# EasyEDA Pro project ProPrj_Altruist.epro, board PCB_Altruist
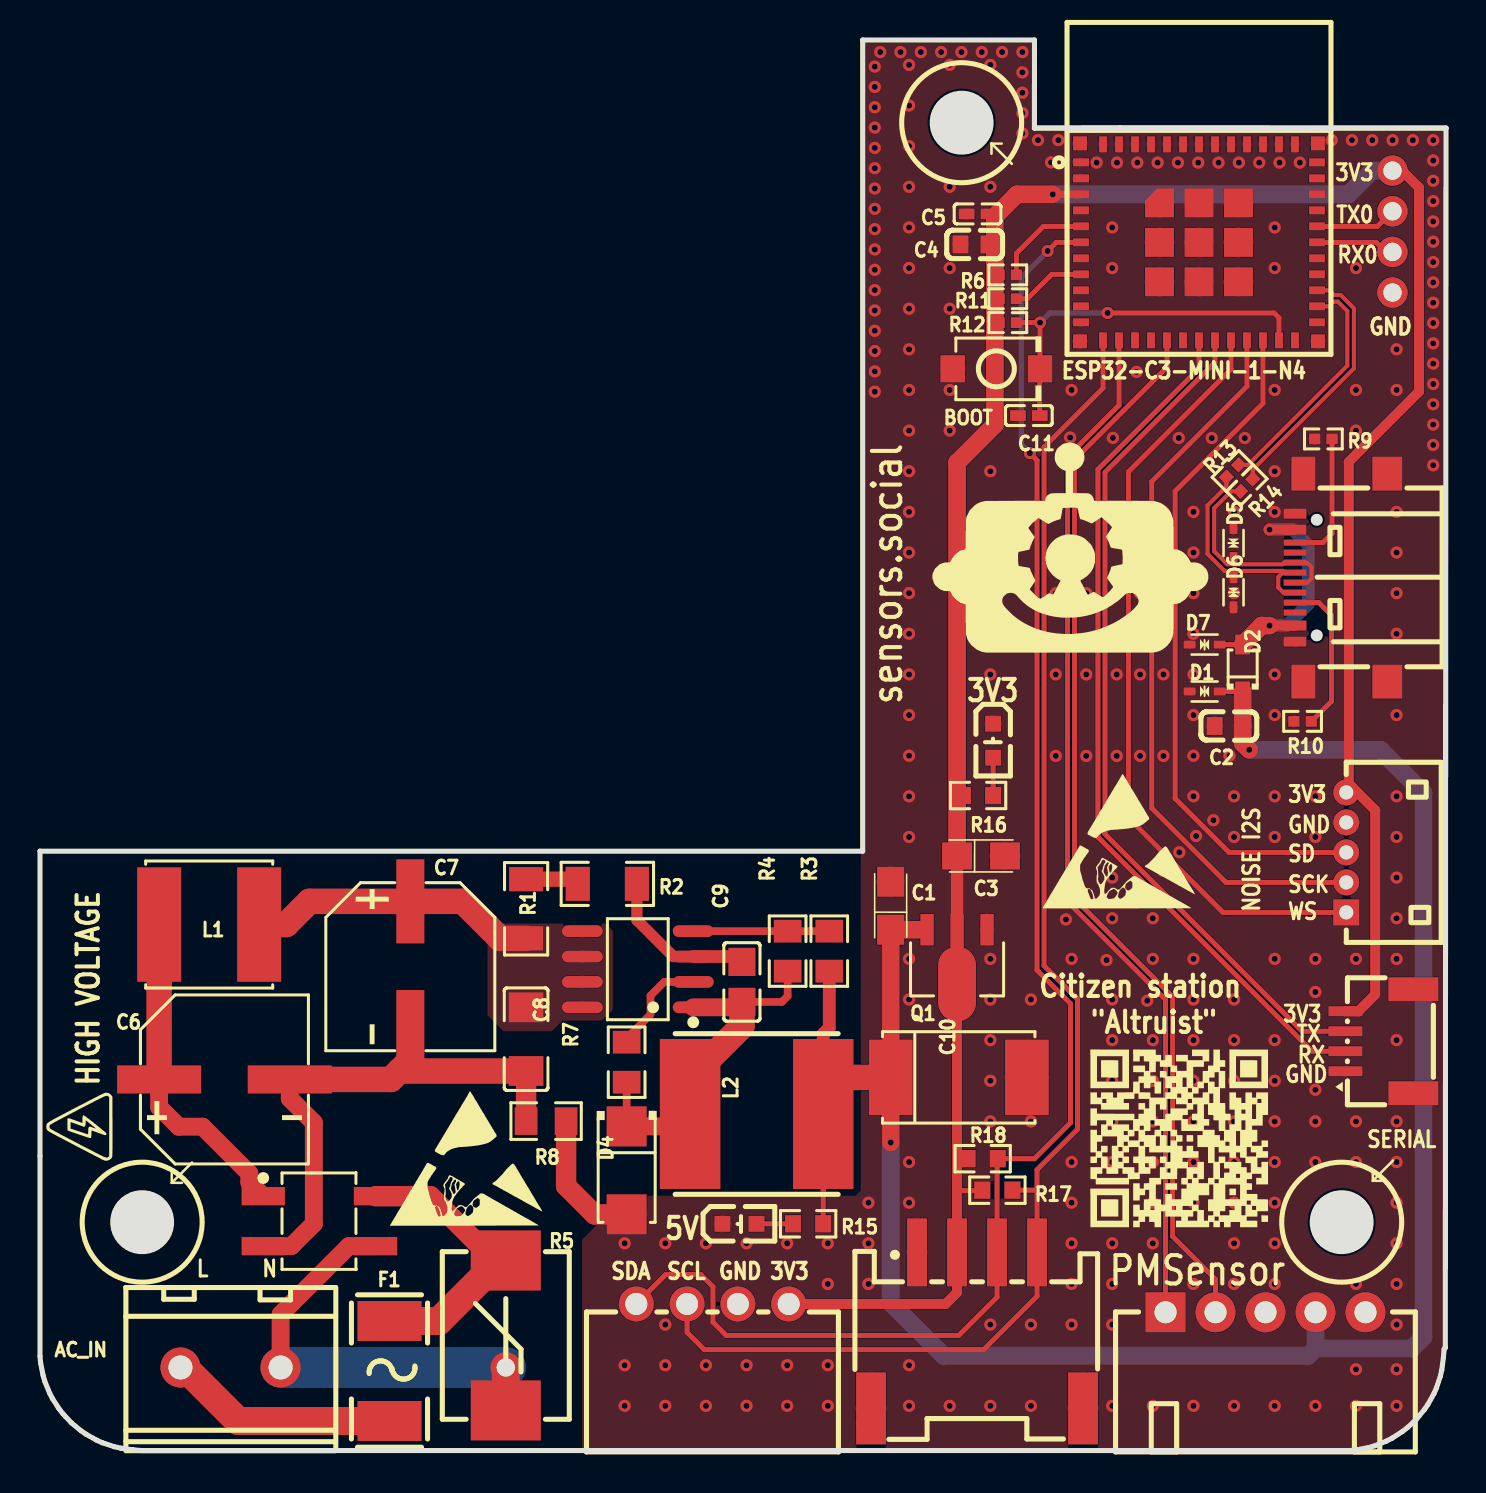
[diagram p7: board, top side]
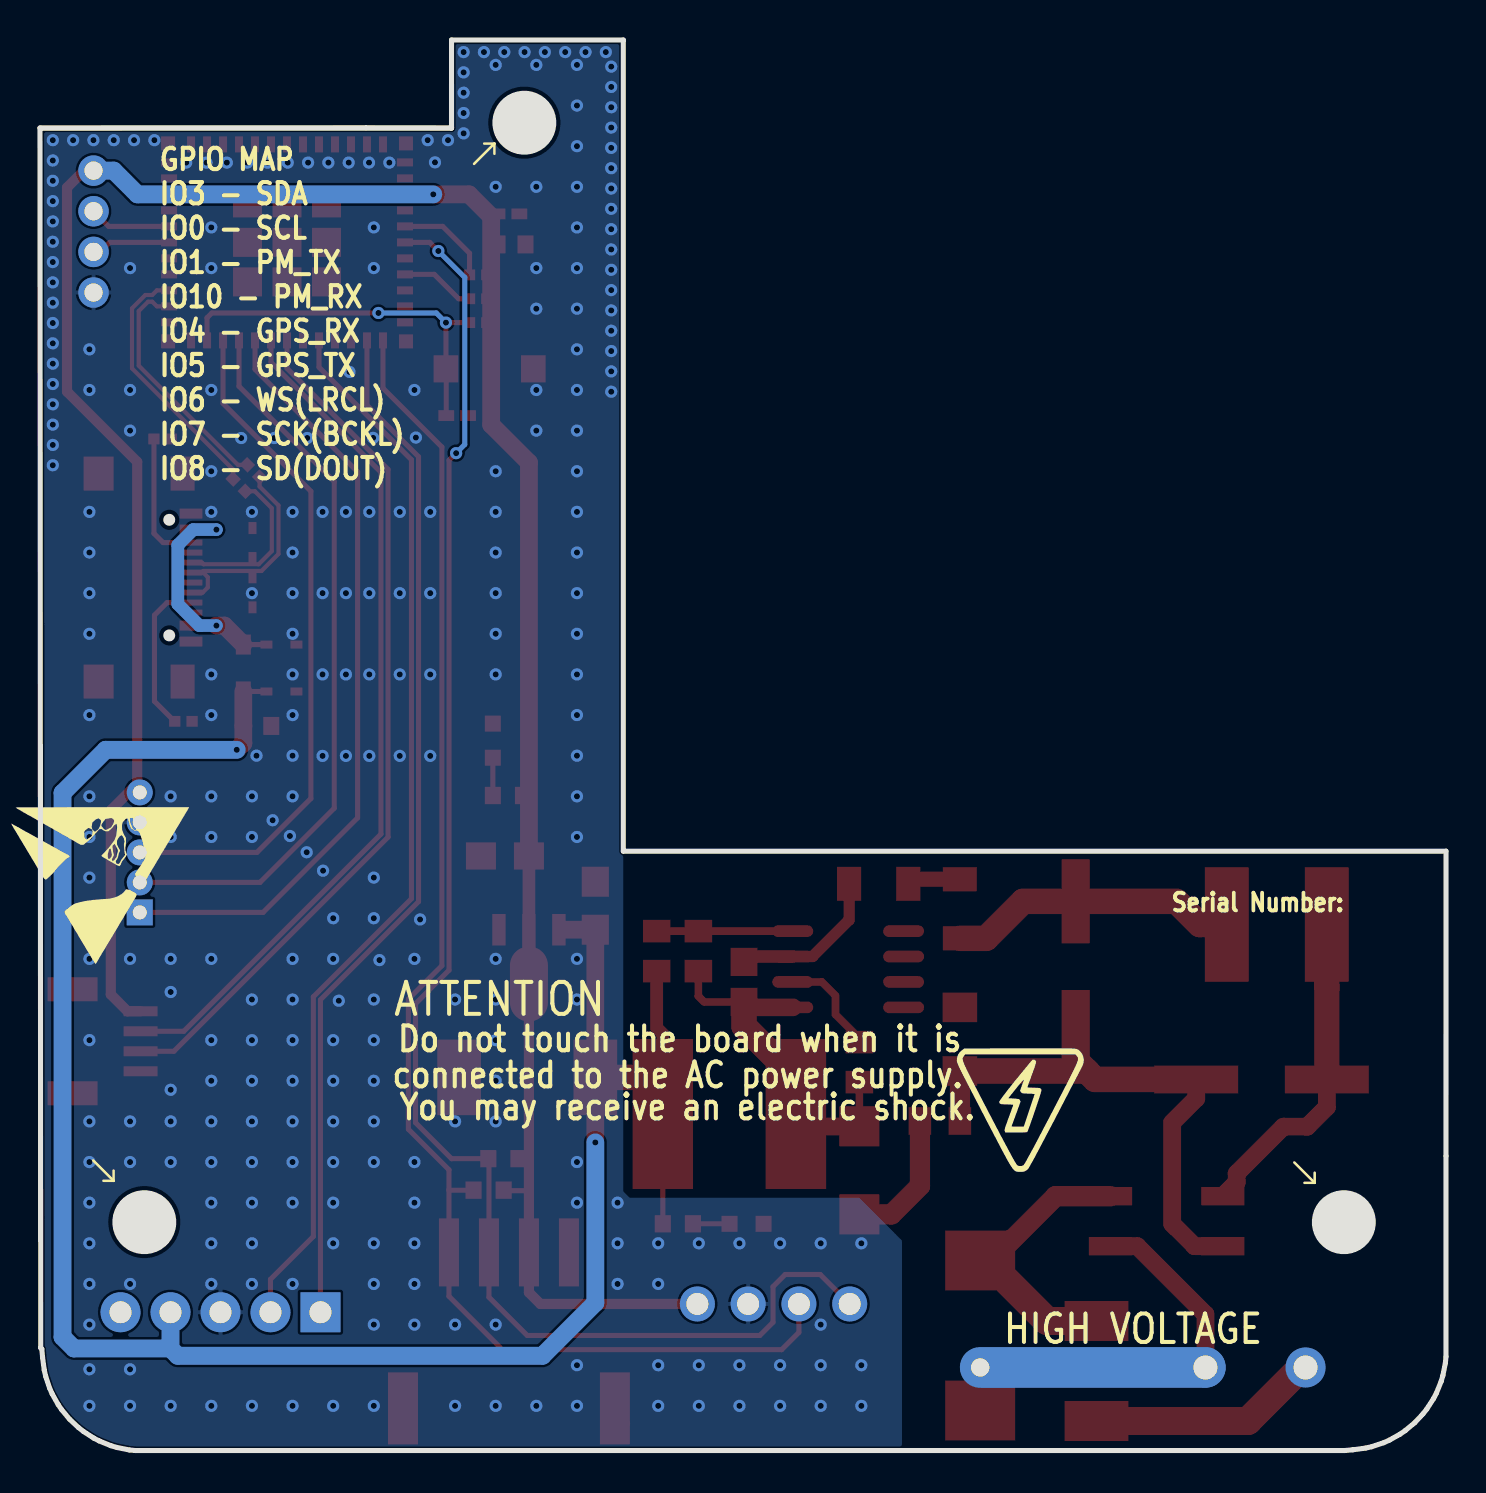
[diagram p8: board, bottom side, seen from below]

Outline 70.32 x 70.54 mm; copper layers: Top Layer, Bottom Layer. Coordinates in mm from the lower left corner of the outline.
Outline path: 49.74,66.13 49.74,70.54 41.15,70.54 41.15,29.97 0,29.97 0,14.73 0,4.7 0.03,4.38 0.16,3.75 0.24,3.45 0.48,2.87 0.62,2.6 0.96,2.08 1.15,1.84 1.57,1.39 2.04,1 2.3,0.82 2.84,0.52 3.12,0.39 3.71,0.19 4.02,0.12 4.66,0.04 5.08,0 65.53,0 65.85,0.03 66.48,0.16 66.78,0.24 67.36,0.48 67.63,0.62 68.15,0.96 68.4,1.15 68.84,1.57 69.24,2.04 69.41,2.3 69.71,2.83 69.84,3.12 70.04,3.71 70.11,4.02 70.19,4.66 70.23,5.08 70.29,5.13 70.32,66.13 ; 49.74,66.13 49.74,68.33 ; 49.74,66.13 70.32,66.13 ; 49.74,66.13 54.01,66.14 70.32,66.13
Stack: Top Layer 0.035mm / Dielectric1 1.51mm FR4 er 4.5 / Bottom Layer 0.035mm

## Design rules (mm)
net DP: DP1
net DN: DP1
net EDN: DP2
net EDP: DP2
template: Custom Config
spacing copperThickness1oz (default): track to track 0.102, other pairs 0.152 to 0.3
spacing copperThickness2oz: track to track 0.203, other pairs 0.152 to 0.3
track width copperThickness1oz (default): min 0.127, default 0.254, max 2.54
track width copperThickness2oz: min 0.203, default 0.254, max 2.54
differential pair differentialPair (default): width min 0.127, default 0.254, max 2.54; gap min 0.152, default 0.152
differential pair differentialPair_usb: width min 0.208, default 0.208, max 0.208; gap min 0.127, default 0.127
via viaSize (default): diameter min 0.5, default 0.61, max 10; hole min 0.3, default 0.305, max 6.299
net GND uses copperRegion_diff_usb
net DP uses copperRegion_diff_usb, differentialPair_usb
net DN uses copperRegion_diff_usb, differentialPair_usb
net EDN uses copperRegion_diff_usb, differentialPair_usb
net EDP uses copperRegion_diff_usb, differentialPair_usb
diff pair DP1 uses differentialPair_usb
diff pair DP2 uses differentialPair_usb

## Placement (name value [footprint] x y rotation side)
AC_IN  WJ127-5.0-2P  [CONN-TH_2P-P5.00_CPC3703CTR]  9.53 4.15 0 top
BOOT  TS-1088-AR02016  [SW-SMD_L3.9-W3.0-P4.45]  47.83 54.09 0 top
C1  22uF  [CASE-A_3216]  42.55 27.24 90 top
C2  10uF  [C0603]  59.45 36.24 180 top
C3  22uF  [CASE-A_3216]  47.07 29.73 0 top
C4  10uF  [C0603]  46.74 60.31 180 top
C5  100nF  [C0402]  46.89 61.84 0 top
C6  3.3uF  [CAP-SMD_BD8.0-L8.3-W8.3-FD]  9.23 18.56 0 top
C7  3.3uF  [CAP-SMD_BD8.0-L8.3-W8.3-FD]  18.52 24.2 270 top
C8  10nF  [C1206]  24.31 20.57 90 top
C9  2.2uF  [C0805]  35.11 23.43 90 top
C10  680uF  [CAP-SMD_L7.3-W4.3]  45.95 18.66 180 top
C11  100nF  [C0402]  49.46 51.75 180 top
CN5  ZX-SH1.0-4PWT  [CONN-SMD_4P-P1.00_MEGASTAR_ZX-SH1.0-4PWT]  66.99 20.47 90 top
D1  LESD5D5.0CT1G  [SOD-523_L1.2-W0.8-LS1.6-BI]  58.25 37.96 180 top
D2  1N5819WS  [SOD-323_L1.8-W1.3-LS2.5-RD]  60.15 39.13 90 top
D3  MB10F  [MBF_L4.8-W3.9-P2.50-LS6.7-BL]  13.97 11.47 270 top
D4  ES1J  [SMA_L4.3-W2.6-LS5.2-RD]  29.34 14.01 270 top
D5  LESD5D5.0CT1G  [SOD-523_L1.2-W0.8-LS1.6-BI]  59.69 45.38 270 top
D6  LESD5D5.0CT1G  [SOD-523_L1.2-W0.8-LS1.6-BI]  59.69 42.92 90 top
D7  LESD5D5.0CT1G  [SOD-523_L1.2-W0.8-LS1.6-BI]  58.25 40.3 0 top
F1  JFC2410-1200FS  [F2410]  17.48 3.98 90 top
L1  680uH  [IND-SMD_L6.0-W6.0]  8.46 26.3 0 top
L2  470uH  [IND-SMD_L8.0-W8.0]  35.84 16.83 180 top
NOREF  -  [Pad_e249]  67.65 64 0 top
NOREF#2  -  [Pad_e431]  67.65 57.91 0 top
NOREF#3  -  [Pad_e2062]  23.3 4.16 0 top
NOREF#4  -  [Pad_e2227]  67.65 61.97 0 top
NOREF#5  -  [Pad_e2228]  67.65 59.94 0 top
PMSensor  X8821WR-05S-N0SN  [CONN-TH_5P-P2.50_X8821WR-05S-N0SN]  61.3 6.92 0 top
Q1  AMS1117-3.3V  [SOT-89-3_L4.5-W2.5-P1.50-LS4.2-BR]  45.87 24.69 90 top
R1  1.5MΩ  [R1206]  24.31 27.09 90 top
R2  1.5MΩ  [R1206]  28.38 28.34 0 top
R3  36kΩ  [R0805]  39.48 24.97 90 top
R4  10kΩ  [R0805]  37.39 24.97 90 top
R5  07D471K68RV0149  [RES-SMD_L8.2-W6.3]  23.3 5.76 90 top
R6  10kΩ  [R0402]  48.41 58.79 0 top
R7  820mΩ  [R0805]  29.34 19.42 90 top
R8  0Ω  [R0805]  25.31 16.47 180 top
R9  5.1kΩ  [R0402]  64.19 50.59 0 top
R10  5.1kΩ  [R0402]  63.15 36.46 0 top
R11  10kΩ  [R0402]  48.41 57.6 0 top
R12  10kΩ  [R0402]  48.41 56.4 180 top
R13  22Ω  [R0402]  59.64 48.99 45 top
R14  22Ω  [R0402]  60.36 48.28 225 top
R15  10K  [R0603]  38.42 11.34 180 top
R16  470  [R0603]  46.92 32.76 0 top
R17  4.7kΩ  [R0603]  47.88 13.02 180 top
R18  4.7kΩ  [R0603]  47.15 14.59 180 top
RadSens  XH-4AW_C2908613  [CONN-TH_XH-4AW]  33.63 7.33 0 top
SHT1  HY2.0-4P-C146060  [CONN-SMD_HY2.0-4P]  46.87 6.01 0 top
U1  ESP32-C3-MINI-1-N4  [WIFIM-SMD_ESP32-C3-MINI-1]  57.97 60.42 0 top
U2  SY50282FAC  [SOIC-8_L4.9-W3.9-P1.27-LS6.0-BL]  29.9 24.07 90 top
U3  XY-ZH1.5-5A21  [CONN-TH_ZH1.5-5AW_C2829750]  65.33 29.91 90 top
U4  -  [SDS011_V3]  39.71 33.01 90 top
USB-C  TYPE-C 16P QTWT  [USB-TYPE-C-SMD_TYPE-C-16P-QTWT]  65.08 43.65 90 top
VD1  19-217/GHC-YR1S2/3T  [LED0603-R-RD]  47.67 35.5 270 top
VD2  19-217/GHC-YR1S2/3T  [LED0603-R-RD]  34.98 11.34 0 top

## Footprints (pads in the part's own frame, mm; a bottom-side part is the same pattern mirrored in y, then rotated)
C0402
  rect 0.79x0.54 smd: 1(-0.545,0) 2(0.545,0)
C0603
  rect 0.8x0.9 smd: 1(-0.7,0) 2(0.7,0)
C0805
  rect 1.41x1.35 smd: 1(-1,0) 2(1,0)
C1206
  rect 1.485x1.728 smd: 1(-1.593,0) 2(1.593,0)
CAP-SMD_BD8.0-L8.3-W8.3-FD
  rect 4.2x1.4 smd: 1(-3.267,0) 2(3.267,0)
CAP-SMD_L7.3-W4.3
  rect 2.185x3.78 smd: 1(3.406,0) 2(-3.406,0)
CASE-A_3216
  rect 1.5x1.359 smd: 1(-1.2,0) 2(1.2,0)
CONN-SMD_4P-P1.00_MEGASTAR_ZX-SH1.0-4PWT
  rect 0.5x1.7 smd: 1(-1.5,1.7) 2(-0.5,1.7) 3(0.5,1.7) 4(1.5,1.7)
  rect 1.2x2.5 smd: 5(2.6,-1.7) 6(-2.6,-1.7)
CONN-SMD_HY2.0-4P
  rect 1x3.4 smd: 1(-3,3.9) 2(-1,3.9) 3(1,3.9) 4(3,3.9)
  rect 1.5x3.6 smd: 5(5.3,-3.9) 6(-5.3,-3.9)
CONN-TH_2P-P5.00_CPC3703CTR
  round 2 hole 1.2: 1(-2.505,0) 2(2.505,0)
CONN-TH_5P-P2.50_X8821WR-05S-N0SN
  rect 2x2 hole 1.1: 1(-5,0)
  round 2 hole 1.1: 2(-2.5,0) 3(0,0) 4(2.5,0) 5(5,0)
CONN-TH_XH-4AW
  round 1.75 hole 1.1: 1(-3.81,0) 2(-1.27,0) 3(1.27,0) 4(3.81,0)
CONN-TH_ZH1.5-5AW_C2829750
  rect 1.3x1.3 hole 0.7: 1(-3,0)
  round 1.3 hole 0.7: 2(-1.5,0) 3(0,0) 4(1.5,0) 5(3,0)
F2410
  rect 2x3.2 smd: 1(-2.5,0) 2(2.5,0)
IND-SMD_L6.0-W6.0
  rect 2.2x5.72 smd: 1(-2.5,0) 2(2.5,0)
IND-SMD_L8.0-W8.0
  rect 3.024x7.5 smd: 1(3.328,0) 2(-3.328,0)
LED0603-R-RD
  rect 0.8x0.8 smd: 1(0.851,0) 2(-0.851,0)
MBF_L4.8-W3.9-P2.50-LS6.7-BL
  rect 0.91x2.165 smd: 1(1.25,2.808) 2(-1.25,2.808) 3(-1.25,-2.808) 4(1.25,-2.808)
Pad_e249
  round 1.524 hole 0.914: 1(0,0)
Pad_e431
  round 1.524 hole 0.914: 1(0,0)
Pad_e2062
  round 1.524 hole 0.914: 1(0,0)
Pad_e2227
  round 1.524 hole 0.914: 1(0,0)
Pad_e2228
  round 1.524 hole 0.914: 2(0,0)
R0402
  rect 0.566x0.54 smd: 1(-0.433,0) 2(0.433,0)
R0603
  rect 0.806x0.864 smd: 1(-0.753,0) 2(0.753,0)
R0805
  rect 1.133x1.377 smd: 1(-1,0) 2(1,0)
R1206
  rect 1.208x1.701 smd: 1(-1.479,0) 2(1.479,0)
RES-SMD_L8.2-W6.3
  rect 3x3.5 smd: 1(-3.75,0) 2(3.75,0)
SMA_L4.3-W2.6-LS5.2-RD
  rect 2x2 smd: 1(-2.2,0) 2(2.2,0)
SOD-323_L1.8-W1.3-LS2.5-RD
  rect 1x0.75 smd: 1(-1.173,0) 2(1.173,0)
SOD-523_L1.2-W0.8-LS1.6-BI
  rect 0.6x0.4 smd: 1(-0.75,0) 2(0.75,0)
SOIC-8_L4.9-W3.9-P1.27-LS6.0-BL
  oval 0.588x2.045 smd: 1(-1.905,-2.772) 2(-0.635,-2.772) 3(0.635,-2.772) 4(1.905,-2.772) 5(1.905,2.772) 6(0.635,2.772) 7(-0.635,2.772) 8(-1.905,2.772)
SOT-89-3_L4.5-W2.5-P1.50-LS4.2-BR
  rect 1.575x0.672 smd: 1(1.356,-1.5) 3(1.356,1.5)
  custom 5.377x1.9 smd: 2(-1.356,0)
SW-SMD_L3.9-W3.0-P4.45
  rect 1.23x1.36 smd: 1(-2.185,0) 2(2.185,0)
USB-TYPE-C-SMD_TYPE-C-16P-QTWT
  rect 1.7x1.2 smd: 0(-5.2,1.891) 0(5.2,1.891)
  rect 1.7x1.5 smd: 0(-5.2,-2.309) 0(5.2,-2.309)
  rect 0.5x1.14 smd: A1(-3.2,2.308) A4(-2.4,2.308) A9(2.4,2.308) A12(3.2,2.308)
  rect 0.3x1.14 smd: A5(-1.25,2.308) A6(-0.25,2.308) A7(0.25,2.308) A8(1.25,2.309) B5(1.75,2.308) B6(0.75,2.308) B7(-0.75,2.308) B8(-1.75,2.309)
WIFIM-SMD_ESP32-C3-MINI-1
  rect 0.8x0.4 smd: 1(-5.9,4) 2(-5.9,3.2) 3(-5.9,2.4) 4(-5.9,1.6) 5(-5.9,0.8) 6(-5.9,0) 7(-5.9,-0.8) 8(-5.9,-1.6) 9(-5.9,-2.4) 10(-5.9,-3.2) 11(-5.9,-4) 25(5.9,-4) 26(5.9,-3.2) 27(5.9,-2.4) 28(5.9,-1.6) 29(5.9,-0.8) 30(5.9,0) 31(5.9,0.8) 32(5.9,1.6) 33(5.9,2.4) 34(5.9,3.2) 35(5.9,4)
  rect 0.4x0.8 smd: 12(-4.8,-4.9) 13(-4,-4.9) 14(-3.2,-4.9) 15(-2.4,-4.9) 16(-1.6,-4.9) 17(-0.8,-4.9) 18(0,-4.9) 19(0.8,-4.9) 20(1.6,-4.9) 21(2.4,-4.9) 22(3.2,-4.9) 23(4,-4.9) 24(4.8,-4.9) 36(4.8,4.9) 37(4,4.9) 38(3.2,4.9) 39(2.4,4.9) 40(1.6,4.9) 41(0.8,4.9) 42(0,4.9) 43(-0.8,4.9) 44(-1.6,4.9) 45(-2.4,4.9) 46(-3.2,4.9) 47(-4,4.9) 48(-4.8,4.9)
  custom 1.45x1.45 smd: 49(-1.975,1.975)
  rect 1.45x1.45 smd: 49(-1.975,0) 49(-1.975,-1.975) 49(0,1.975) 49(0,0) 49(0,-1.975) 49(1.975,1.975) 49(1.975,0) 49(1.975,-1.975)
  rect 0.7x0.7 smd: 50(5.95,4.95) 51(5.95,-4.95) 52(-5.95,-4.95) 53(-5.95,4.95)

## Nets
As in the schematic, except:
GND: BOOT.1 C1.2 C2.2 C3.2 C4.2 C5.1 C10.2 C11.2 CN5.1 D1.2 D4.2 D5.1 D6.1 D7.1 NOREF#2.1 PMSensor.3 Q1.1 R8.1 R9.1 R10.1 RadSens.3 SHT1.1 SHT1.5 SHT1.6 U1.1 U1.2 U1.11 U1.14 U1.36 U1.37 U1.38 U1.39 U1.40 U1.41 U1.42 U1.43 U1.44 U1.45 U1.46 U1.47 U1.48 U1.49 U1.50 U1.51 U1.52 U1.53 U3.4 USB-C.A1 USB-C.A12 VD1.2 VD2.2
VDD3V3: C3.1 C4.1 C5.2 CN5.4 NOREF.1 Q1.2 R6.1 R11.1 R12.2 R16.1 R17.2 R18.2 RadSens.4 SHT1.2 U1.3 U3.5
N_IN: AC_IN.2 D3.1 NOREF#3.1 R5.1
U0RXD: NOREF#5.2 U1.30
U0TXD: NOREF#4.1 U1.31

Pads without a net: CN5 5 6; PMSensor 5; U1 4 7 9 10 15 17 24 25 28 29 32 33 34 35; USB-C 0 A8 B8

## Via types
v1: diameter 0.61, hole 0.305, Top Layer to Bottom Layer, 298 vias

## Routing (per net, layer and track width the routed paths; a pad name or vN(x,y) marks a point on that pad's centre or on a via; arc(x,y) is an arc through that point)
GND: length 8.8
  Top Layer w0.254: 41.06,1.47 41.49,1.91 41.49,2.03 ; 41.06,1.47 40.93,1.35 ; 41.06,1.47 41.06,1.68 41.49,2.11 41.49,2.03 ; 41.49,2.03 SHT1.6
  Top Layer w1.016: D4.2 27.73,11.81 26.31,13.23 R8.1
  vias: v1(29.24,10.36) v1(29.24,4.27) v1(29.24,2.24) v1(31.28,10.36) v1(31.28,6.3) v1(31.28,4.27) v1(31.28,2.24) v1(33.31,10.36) v1(33.31,4.27) v1(33.31,2.24) v1(35.34,10.36) v1(35.34,4.27) v1(35.34,2.24) v1(37.37,10.36) v1(37.37,4.27) v1(37.37,2.24) v1(39.4,10.36) v1(39.4,8.33) v1(39.4,4.27) v1(39.4,2.24) v1(41.44,12.4) v1(41.44,10.36) v1(41.44,8.33) v1(41.75,69.2) v1(41.75,68.19) v1(41.75,67.17) v1(41.75,66.16) v1(41.75,65.14) v1(41.75,64.12) v1(41.75,63.11) v1(41.75,62.09) v1(41.75,61.08) v1(41.75,60.06) v1(41.75,59.05) v1(41.75,58.03) v1(41.75,57.01) v1(41.75,56) v1(41.75,54.98) v1(41.75,53.97) v1(41.75,52.95) v1(42.02,69.93) v1(43.04,69.93) v1(43.47,69.29) v1(43.47,67.26) v1(43.47,65.23) v1(43.47,63.2) v1(43.47,61.16) v1(43.47,59.13) v1(43.47,57.1) v1(43.47,55.07) v1(43.47,53.03) v1(43.47,51) v1(43.47,48.97) v1(43.47,46.94) v1(43.47,44.91) v1(43.47,42.88) v1(43.47,40.84) v1(43.47,38.81) v1(43.47,36.78) v1(43.47,34.75) v1(43.47,32.72) v1(43.47,30.68) v1(43.47,24.59) v1(43.47,22.56) v1(43.47,14.43) v1(43.47,12.4) v1(43.47,4.27) v1(43.47,2.24) v1(44.06,69.93) v1(45.07,69.93) v1(45.5,69.29) v1(45.5,63.2) v1(45.5,59.13) v1(45.5,57.1) v1(45.5,53.03) v1(45.5,51) v1(45.5,2.24) v1(46.09,69.93) v1(47.1,69.93) v1(47.53,69.29) v1(47.53,63.2) v1(47.53,48.97) v1(47.53,46.94) v1(47.53,44.91) v1(47.53,42.88) v1(47.53,40.84) v1(47.53,38.81) v1(47.53,24.59) v1(47.53,22.56) v1(47.53,20.52) v1(47.53,18.49) v1(47.53,16.46) v1(47.53,6.3) v1(47.53,2.24) v1(48.12,69.93) v1(49.13,69.93) v1(49.13,68.92) v1(49.13,67.9) v1(49.13,66.88) v1(49.13,65.87) v1(49.56,22.56) v1(49.56,16.46) v1(49.56,6.3) v1(49.56,2.24) v1(49.92,65.53) v1(50.57,64.42) v1(50.81,46.94) v1(50.81,42.88) v1(50.81,38.81) v1(50.81,34.74) v1(50.93,65.53) v1(51.31,26.56) v1(51.52,50.66) v1(51.59,53.03) v1(51.59,24.59) v1(51.59,14.43) v1(51.59,12.4) v1(51.59,10.36) v1(51.59,8.33) v1(51.59,6.3) v1(52.33,46.94) v1(52.33,42.88) v1(52.33,38.81) v1(52.33,34.74) v1(52.85,64.4) v1(53.34,24.53) v1(53.63,61.16) v1(53.63,59.13) v1(53.66,50.64) v1(53.63,28.65) v1(53.63,26.62) v1(53.63,22.56) v1(53.63,20.52) v1(53.63,18.49) v1(53.63,16.46) v1(53.63,14.43) v1(53.63,10.36) v1(53.63,8.33) v1(53.63,6.3) v1(53.63,2.24) v1(53.87,64.4) v1(53.85,46.94) v1(53.85,42.88) v1(53.85,38.81) v1(53.85,34.74) v1(54.88,64.4) v1(54.84,53.94) v1(55.02,46.94) v1(55.02,42.88) v1(55.02,38.81) v1(55.02,34.74) v1(55.38,22.49) v1(55.66,26.62) v1(55.66,24.59) v1(55.66,20.52) v1(55.66,18.49) v1(55.66,16.46) v1(55.66,14.43) v1(55.66,12.4) v1(55.66,10.36) v1(55.66,2.24) v1(55.9,64.4) v1(56.19,46.94) v1(56.19,42.88) v1(56.19,38.81) v1(56.19,34.74) v1(56.16,29) v1(56.91,64.4) v1(56.96,50.63) v1(56.98,29.92) v1(57.69,46.94) v1(57.69,44.91) v1(57.69,42.88) v1(57.69,40.84) v1(57.69,38.81) v1(57.69,36.78) v1(57.69,34.75) v1(57.69,32.72) v1(57.69,24.59) v1(57.69,22.56) v1(57.69,20.52) v1(57.69,18.49) v1(57.69,16.46) v1(57.69,14.43) v1(57.69,12.4) v1(57.69,8.33) v1(57.69,2.24) v1(57.82,30.73) v1(57.93,64.4) v1(58.61,50.63) v1(58.69,31.52) v1(58.95,64.4) v1(59.49,34.75) v1(59.72,46.94) v1(59.72,42.88) v1(59.72,32.72) v1(59.72,30.68) v1(59.72,22.56) v1(59.72,20.52) v1(59.72,18.49) v1(59.72,16.46) v1(59.72,14.43) v1(59.72,12.4) v1(59.72,10.36) v1(59.72,8.33) v1(59.72,2.24) v1(59.96,64.4) v1(60.26,50.63) v1(60.98,64.4) v1(61.75,61.16) v1(61.75,59.13) v1(61.75,53.03) v1(61.75,48.97) v1(61.75,46.94) v1(61.75,38.81) v1(61.75,36.78) v1(61.75,32.72) v1(61.75,30.68) v1(61.75,24.59) v1(61.75,20.52) v1(61.75,18.49) v1(61.75,16.46) v1(61.75,14.43) v1(61.75,12.4) v1(61.75,10.36) v1(61.75,8.33) v1(61.75,2.24) v1(61.99,64.4) v1(63.01,64.4) v1(63.79,32.72) v1(63.79,30.68) v1(63.79,24.59) v1(63.79,22.93) v1(63.79,18.04) v1(63.79,16.46) v1(63.79,14.43) v1(63.79,2.24) v1(64.6,65.53) v1(65.62,65.53) v1(65.82,59.13) v1(65.82,53.03) v1(65.82,51) v1(65.82,24.59) v1(65.82,16.46) v1(65.82,14.43) v1(65.82,8.33) v1(65.82,4.06) v1(65.82,2.24) v1(66.63,65.53) v1(67.65,65.53) v1(67.85,55.07) v1(67.85,53.03) v1(67.85,46.94) v1(67.85,44.91) v1(67.85,42.88) v1(67.85,40.84) v1(67.85,36.78) v1(67.85,32.72) v1(67.85,30.68) v1(67.85,28.65) v1(67.85,26.62) v1(67.85,24.59) v1(67.85,20.52) v1(67.85,16.46) v1(67.85,14.43) v1(67.85,12.4) v1(67.85,10.36) v1(67.85,8.33) v1(67.85,6.3) v1(67.85,4.06) v1(67.85,2.24) v1(68.67,65.53) v1(69.68,65.53) v1(69.68,64.51) v1(69.68,63.5) v1(69.68,62.48) v1(69.68,61.46) v1(69.68,60.45) v1(69.68,59.43) v1(69.68,58.42) v1(69.68,57.4) v1(69.68,56.38) v1(69.68,55.37) v1(69.68,54.35) v1(69.68,53.34) v1(69.68,52.32) v1(69.68,51.3) v1(69.68,50.29) v1(69.68,49.27)
GNDS: length 18.5
  Top Layer w0.381: C9.1 37.1,22.43 37.39,22.72 R4.1 ; R7.1 D4.1
  Top Layer w0.889: D4.1 31.9,16.21 L2.1 ; U2.1 34.84,22.16 C9.1
  Top Layer w1.27: L2.1 32.52,18.63 35.11,21.22 C9.1
VBUSA: length 13
  Top Layer w0.254: D7.2 D2.2
  Top Layer w0.508: USB-C.A9 v1(61.5,46.05) ; v1(61.5,41.25) USB-C.A4
  Top Layer w0.889: v1(61.5,41.25) 61.1,41.25 D2.2
  Bottom Layer w0.635: v1(61.5,41.25) 62.35,41.25 63.43,42.33 63.43,45.28 62.65,46.05 v1(61.5,46.05)
VDD3V3: length 132.7
  Top Layer w0.254: 45.87,13.08 45.96,12.99 47.11,12.99 R17.2
  Top Layer w0.381: 65.36,32.88 U3.5 ; U1.3 v1(50.65,62.82)
  Top Layer w0.508: Q1.2 SHT1.2 45.87,7.91 45.29,7.33 RadSens.4 ; NOREF.1 68.12,64 68.97,63.15 68.97,52.95 65.46,49.44 65.46,33.34 66.78,32.02 66.78,22.81 65.94,21.97 CN5.4
  Top Layer w0.635: C3.1 Q1.2
  Top Layer w0.889: C3.1 45.87,49.41 47.76,51.3 47.76,61.71 48.86,62.82 v1(50.65,62.82)
  Bottom Layer w0.889: v1(50.65,62.82) 65.45,62.82 66.64,64 NOREF.1
VDD5V: length 107.5
  Top Layer w0.254: R15.1 L2.2 ; D1.1 60.15,37.96
  Top Layer w0.635: R3.1 39.48,21.14 39.17,20.83 39.17,17.87
  Top Layer w0.889: v1(42.55,15.41) C10.1 C1.1 44,26.04 ; v1(60.48,35.04) 60.15,35.37 C2.1 60.15,37.96
  Top Layer w1.27: L2.2 39.17,17.87 39.96,18.66 C10.1
  Bottom Layer w0.889: 63.8,5.11 63.43,4.74 45.19,4.74 42.55,7.38 v1(42.55,15.41) ; 63.8,5.11 68.62,5.11 69.19,5.68 69.19,32.88 67.04,35.04 v1(60.48,35.04) ; 63.8,5.11 63.8,5.11 PMSensor.4
DN: length 10.8
  Top Layer w0.208: 62.16,43.9 61.93,43.68 61.93,43.16 62.19,42.9 USB-C.B7 ; 62.16,43.9 USB-C.A7 ; 62.16,43.9 62.16,43.98 59.24,43.98 58.39,44.83 58.39,47.26 59.34,48.21 R13.1
DP: length 10.6
  Top Layer w0.208: R14.2 59.58,47.97 58.73,47.12 58.73,44.97 59.38,44.32 62.14,44.32 62.22,44.4 USB-C.B6 62.78,44.39 63.39,44.39 63.6,44.18 63.6,43.61 63.39,43.4 USB-C.A6
EDN: length 12
  Top Layer w0.208: R13.2 60.42,49.29 65.38,54.25 65.38,56.98 64.92,57.45 64.71,57.45 64.48,57.22 U1.26
EDP: length 12.9
  Top Layer w0.208: R14.1 60.66,49.06 65.72,54.11 65.72,57.12 65.06,57.78 64.71,57.78 64.48,58.02 63.87,58.02
GPS_RX: length 43.7
  Top Layer w0.254: CN5.2 63.62,19.97 52.91,30.68 52.91,49.06 57.97,54.12 57.97,55.52
GPS_TX: length 43.1
  Top Layer w0.254: 58.77,55.52 58.77,54.42 53.27,48.92 53.27,30.83 63.13,20.97 CN5.3
I2S_SCK: length 36.6
  Top Layer w0.254: 60.37,55.52 60.37,53.22 55.61,48.45 55.61,32.12 59.32,28.41 U3.2
I2S_SD: length 34.4
  Top Layer w0.254: U3.3 59.47,29.91 56.77,32.61 56.77,47.97 61.17,52.36 61.17,55.52
I2S_WS: length 38.9
  Top Layer w0.254: 59.57,55.52 59.57,54.07 54.44,48.94 54.44,31.64 59.16,26.91 U3.1
L_IN: length 11.6
  Top Layer w1.397: F1.1 9.91,1.48 7.03,4.36
N_IN: length 22.2
  Top Layer w0.889: D3.1 15.44,10.22 12.03,6.81 AC_IN.2
  Top Layer w1.397: NOREF#3.1 R5.1
  Bottom Layer w2.032: 12.04,4.16 NOREF#3.1
PM_RX: length 53.4
  Top Layer w0.254: PMSensor.2 58.8,8.56 56.65,10.71 56.65,22.69 51.75,27.59 51.75,49.55 56.37,54.17 56.37,55.52
PM_TX: length 51.7
  Top Layer w0.254: 53.97,55.52 53.97,52.28 51.39,49.7 51.39,27.45 56.3,22.54 PMSensor.1
SCL: length 72.2
  Top Layer w0.254: R17.1 49.86,13.02 49.87,13.03 ; 49.87,13.03 SHT1.4 49.87,7.71 47.2,5.04 33.23,5.04 32.37,5.91 RadSens.2 ; 49.87,13.03 49.87,14.04 51.9,16.07 51.9,22.57 50.22,24.25 50.22,50.18 53.17,53.13 53.17,55.52
SDA: length 80.1
  Top Layer w0.254: U1.6 50.83,60.42 v1(50.4,59.98) ; RadSens.1 31.3,8.8 33.05,8.8 33.66,8.19 33.66,6.42 34.32,5.76 45.95,5.76 47.87,7.67 SHT1.3 47.87,14.56 R18.1 49.74,14.59 51.54,16.4 51.54,22.34 49.87,24.02 49.87,49.52 v1(49.51,49.88)
  Bottom Layer w0.254: v1(49.51,49.88) 49.08,50.31 49.08,58.66 v1(50.4,59.98)
U0RXD: length 4
  Top Layer w0.254: U1.30 66.83,60.42 67.31,59.94 NOREF#5.2
U0TXD: length 4.1
  Top Layer w0.254: NOREF#4.1 66.89,61.22 U1.31
$1N20079: length 1.8
  Top Layer w0.254: VD2.1 37.67,11.34
$1N20100: length 1.9
  Top Layer w0.254: 47.67,34.65 R16.2
$1N20115: length 2.7
  Top Layer w0.762: 26.9,28.34 26.66,28.57 R1.2
$1N20116: length 5.2
  Top Layer w0.381: R7.2 29.34,20.61 30.54,21.81 30.54,22.75 31.22,23.43 U2.2
$1N20117: length 7.9
  Top Layer w0.559: R2.2 29.86,26.53 31.68,24.7 U2.3
  Top Layer w0.635: C9.2 34.84,24.7 U2.3
$1N20118: length 6.8
  Top Layer w0.381: R3.2 R4.2 U2.4
$1N20123: length 16.4
  Top Layer w0.889: D3.3 10.47,13.42 10.47,13.86 8.13,16.19 6.94,16.19 5.96,17.18 C6.1
  Top Layer w1.27: C6.1 5.96,23.19 5.96,23.19 L1.1
$1N20125: length 14.6
  Top Layer w1.016: 22.98,9.51 22.74,9.51 19.53,12.72 D3.2
  Top Layer w1.3: 22.98,9.51 R5.2
  Top Layer w1.397: F1.2 19.95,6.48 22.98,9.51
$1N20128: length 14.6
  Top Layer w1.27: L1.2 12.32,26.3 13.48,27.46 C7.1 21.15,27.46 23,25.61 R1.1
$1N20129: length 27.4
  Top Layer w0.889: C6.2 12.49,17.6 13.7,16.4 13.7,11.34 12.57,10.22 D3.4
  Top Layer w1.016: C8.1 R8.2
  Top Layer w1.27: 17.97,18.98 C8.1 ; 17.97,18.98 17.55,18.56 C6.2 ; 17.97,18.98 18.52,19.53 C7.2
$1N20204: length 6.8
  Top Layer w0.254: USB-C.B5 64.16,45.4 64.62,45.86 R9.2
$1N20205: length 7.8
  Top Layer w0.254: USB-C.A5 63.97,42.4 64.6,41.77 64.6,37.47 63.59,36.46 R10.2
$1N46971: length 4.9
  Top Layer w0.254: U1.5 50.18,61.22 48.84,59.87 48.84,58.79
$1N46973: length 3.7
  Top Layer w0.254: 48.84,57.6 49.38,57.6 50.6,58.82 U1.8
$1N50749: length 19.2
  Top Layer w0.254: v1(53.4,56.89) 61.73,56.89 61.97,56.64 61.97,55.52 ; C11.1 50,54.08 BOOT.2 v1(50.02,56.4) 48.84,56.4
  Bottom Layer w0.254: v1(53.4,56.89) 50.5,56.89 v1(50.02,56.4)

## Copper pours and planes (outline as drawn; the poured copper is in the pictures)
GND on Top Layer: -5.75,80.08 70.32,80.08 70.32,-0.95 -5.75,-0.95
GND on Bottom Layer: -6.07,71.16 73.03,71.16 73.03,-14.13 -6.07,-14.13
$1N20128 on Top Layer: 22.48,26.25 28.25,26.25 28.56,25.95 28.56,22.09 28.07,21.61 26.09,21.61 25.56,21.07 23.22,21.07 22.48,21.81

## Text on the board
Bottom Silkscreen Layer: Serial Number: | GPIO MAP / IO3 - SDA / IO0 - SCL / IO1 - PM_TX / IO10 - PM_RX / IO4 - GPS_RX / IO5 - GPS_TX / IO6 - WS(LRCL) / IO7 - SCK(BCKL) / IO8 - SD(DOUT) | You may receive an electric shock. | Do not touch the board when it is | connected to the AC power supply. | HIGH VOLTAGE | ATTENTION
Top Silkscreen Layer: L | N | 3V3 | GND | TX | RX | TX0 | RX0 | SERIAL | NOISE I2S | SD | SCK | WS | SDA | SCL | ESP32-C3-MINI-1-N4 | 5V | HIGH VOLTAGE | Citizen station | "Altruist" | PMSensor | sensors.social
